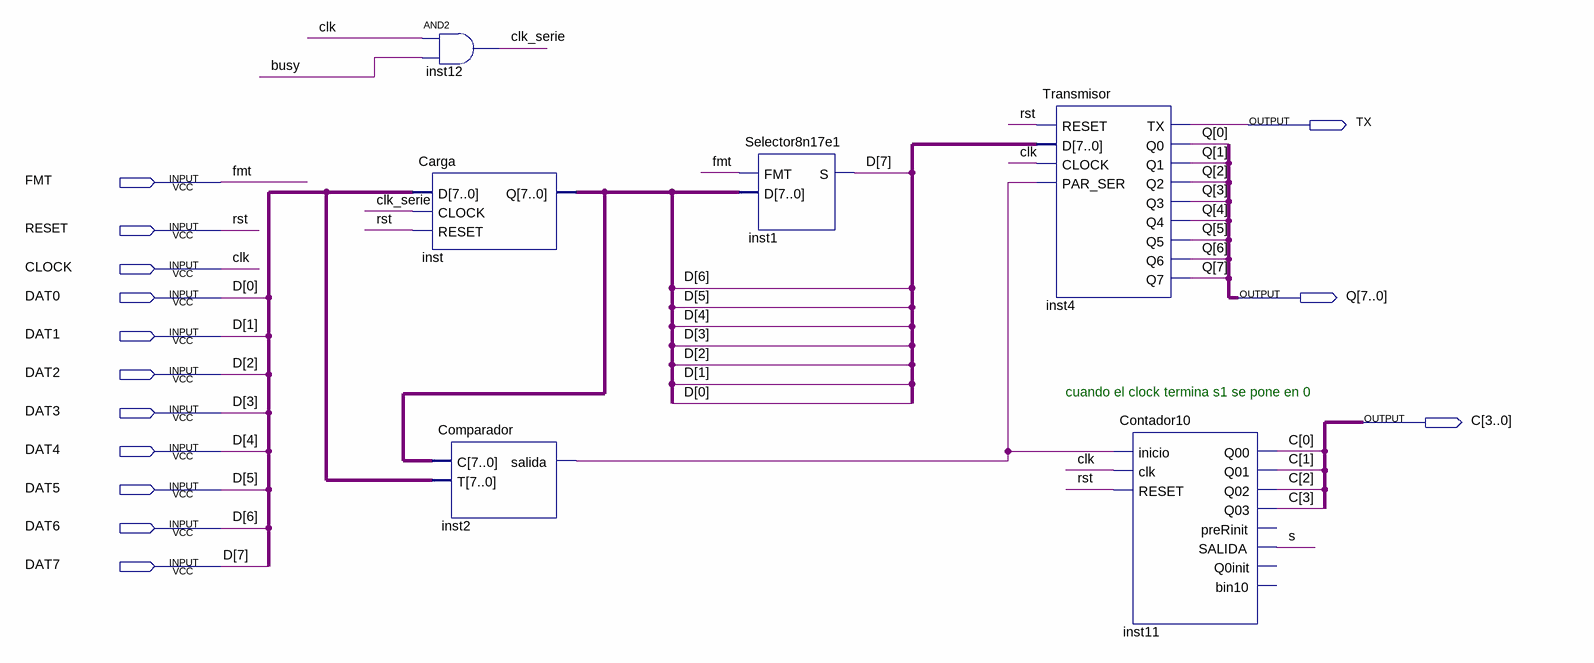
[diagram p0: schematic sheet]
// Quartus schematic UART.bdf as structural Verilog: 6 symbols, 14 pins
module UART (
  input  FMT,
  input  RESET,
  input  CLOCK,
  input  DAT0,
  input  DAT1,
  input  DAT2,
  input  DAT3,
  input  DAT4,
  input  DAT5,
  input  DAT6,
  input  DAT7,
  output TX,
  output [7:0] Q,
  output [3:0] C
);

  wire busy, clk_serie, inst2_salida, s;
  wire [7:0] inst_q, undriven, undriven_2;

  and inst12 (clk_serie, CLOCK, busy);
  Carga inst (.D(undriven), .CLOCK(clk_serie), .RESET(RESET), .Q(inst_q));
  Comparador inst2 (.C(inst_q), .T(undriven), .salida(inst2_salida));
  Selector8n17e1 inst1 (.FMT(FMT), .D(inst_q), .S(DAT7));
  Transmisor inst4 (
    .RESET(RESET), .D(undriven_2), .CLOCK(CLOCK), .PAR_SER(inst2_salida), .TX(TX), .Q0(Q[0]), .Q1(Q[1]),
    .Q2(Q[2]), .Q3(Q[3]), .Q4(Q[4]), .Q5(Q[5]), .Q6(Q[6]), .Q7(Q[7]));
  Contador10 inst11 (
    .inicio(inst2_salida), .clk(CLOCK), .RESET(RESET), .Q00(C[0]), .Q01(C[1]), .Q02(C[2]), .Q03(C[3]),
    .SALIDA(s));  // open: preRinit, Q0init, bin10

  // Other names for the same wires on the sheet: clk = CLOCK;
  //   D[7:0] = {DAT7, DAT6, DAT5, DAT4, DAT3, DAT2, DAT1, DAT0}; rst = RESET

  // Notes on the sheet:
  //   cuando el clock termina s1 se pone en 0
endmodule
